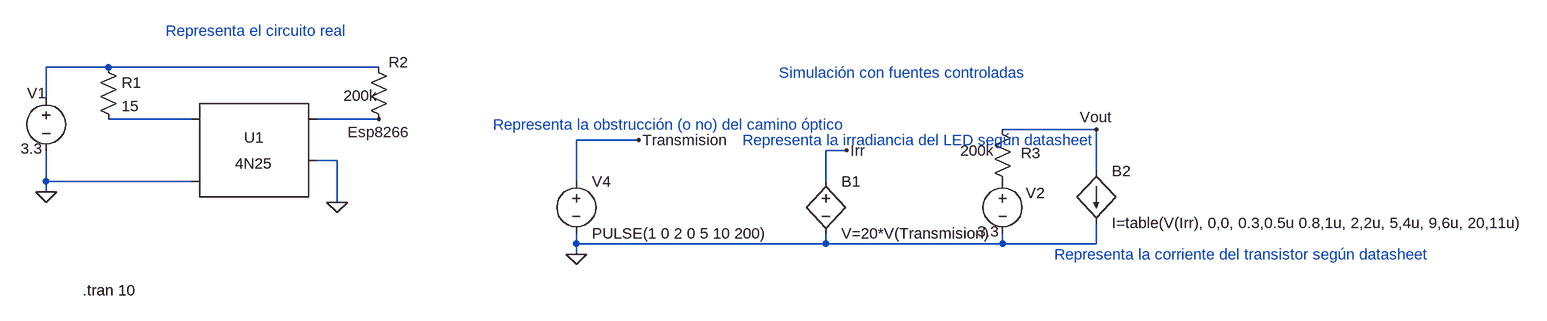
[diagram p0: schematic proyecto_final.asc]
proyecto_final.asc, the LTspice schematic file:
Version 4.1
SHEET 1 2484 680
WIRE 112 96 16 96
WIRE 528 96 112 96
WIRE 16 144 16 96
WIRE 240 176 112 176
WIRE 528 176 432 176
WIRE 1632 192 1488 192
WIRE 928 208 832 208
WIRE 1248 224 1216 224
WIRE 464 240 432 240
WIRE 1632 256 1632 192
WIRE 16 272 16 224
WIRE 240 272 16 272
WIRE 832 272 832 208
WIRE 1216 272 1216 224
WIRE 16 288 16 272
WIRE 464 304 464 240
WIRE 832 368 832 352
WIRE 1216 368 1216 352
WIRE 1216 368 832 368
WIRE 1488 368 1488 352
WIRE 1488 368 1216 368
WIRE 1632 368 1632 336
WIRE 1632 368 1488 368
WIRE 832 384 832 368
FLAG 464 304 0
FLAG 16 288 0
FLAG 928 208 Transmision
FLAG 832 384 0
FLAG 1248 224 Irr
FLAG 1632 192 Vout
FLAG 528 176 Esp8266
SYMBOL voltage 16 128 R0
WINDOW 123 0 0 Left 2
WINDOW 39 0 0 Left 2
WINDOW 0 -29 8 Left 2
WINDOW 3 -39 93 Left 2
SYMATTR InstName V1
SYMATTR Value 3.3
SYMBOL res 512 80 R0
WINDOW 0 31 8 Left 2
WINDOW 3 -38 60 Left 2
SYMATTR InstName R2
SYMATTR Value 200k
SYMBOL Optos\\4N25 336 240 R0
SYMATTR InstName U1
SYMBOL bv 1216 256 R0
SYMATTR InstName B1
SYMATTR Value V=20*V(Transmision)
SYMBOL bi 1632 256 R0
SYMATTR InstName B2
SYMATTR Value I=table(V(Irr), 0,0, 0.3,0.5u 0.8,1u, 2,2u, 5,4u, 9,6u, 20,11u)
SYMBOL res 1472 176 R0
WINDOW 0 44 52 Left 2
WINDOW 3 -49 48 Left 2
SYMATTR InstName R3
SYMATTR Value 200k
SYMBOL voltage 1488 256 R0
WINDOW 123 0 0 Left 2
WINDOW 39 0 0 Left 2
WINDOW 0 36 34 Left 2
WINDOW 3 -39 93 Left 2
SYMATTR InstName V2
SYMATTR Value 3.3
SYMBOL voltage 832 256 R0
WINDOW 123 0 0 Left 0
WINDOW 39 0 0 Left 0
SYMATTR InstName V4
SYMATTR Value PULSE(1 0 2 0 5 10 200)
SYMBOL res 96 80 R0
SYMATTR InstName R1
SYMATTR Value 15
TEXT 72 440 Left 2 !.tran 10
TEXT 200 40 Left 2 ;Representa el circuito real
TEXT 1144 104 Left 2 ;Simulación con fuentes controladas
TEXT 704 184 Left 2 ;Representa la obstrucción (o no) del camino óptico
TEXT 1088 208 Left 2 ;Representa la irradiancia del LED según datasheet
TEXT 1568 384 Left 2 ;Representa la corriente del transistor según datasheet

The netlist it stands for:
* proyecto_final.asc
V1 N001 0 3.3
R2 N001 Esp8266 200k
X§U1 N002 0 Esp8266 0 NC_01 4N25
B1 Irr 0 V=20*V(Transmision)
B2 Vout 0 I=table(V(Irr), 0,0, 0.3,0.5u 0.8,1u, 2,2u, 5,4u, 9,6u, 20,11u)
R3 Vout P001 200k
V2 P001 0 3.3
V4 Transmision 0 PULSE(1 0 2 0 5 10 200)
R1 N001 N002 15
.tran 10
* Representa el circuito real
* Simulación con fuentes controladas
* Representa la obstrucción (o no) del camino óptico
* Representa la irradiancia del LED según datasheet
* Representa la corriente del transistor según datasheet
.lib 4N25.sub
.backanno
.end